# Altium schematic sheet I2C_EEPROM_AT24C32.SchDoc
size A4; SheetNumber: 11; SheetTotal: 16
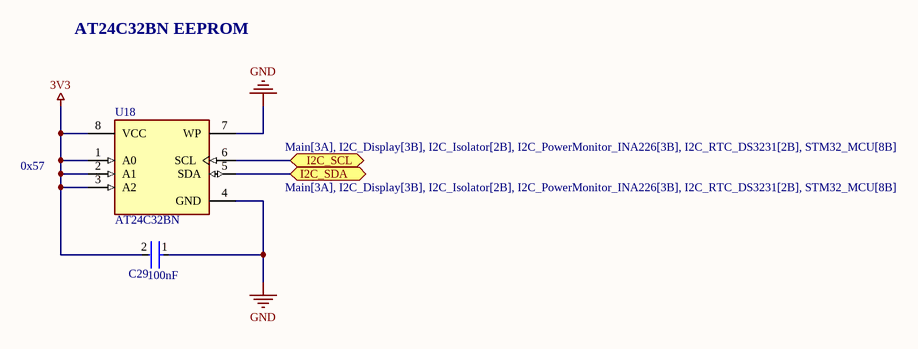
[diagram p0: I2C_EEPROM_AT24C32.SchDoc]

## Parts
C29  100nF  [FP-CGA3E-0_3-0_1-IPC_A]
U18  AT24C32BN  [FP-C04-057-SN-MFG]

## Ports
I2C_SCL (bidir, see Main[3A], I2C_Display[3B], I2C_Isolator[2B], I2C_PowerMonitor_INA226[3B], I2C_RTC_DS3231[2B], STM32_MCU[8B]), I2C_SDA (bidir, see Main[3A], I2C_Display[3B], I2C_Isolator[2B], I2C_PowerMonitor_INA226[3B], I2C_RTC_DS3231[2B], STM32_MCU[8B])

## Nets
3V3: C29.2 U18.1(A0) U18.2(A1) U18.3(A2) U18.8(VCC)
GND: C29.1 U18.4(GND) U18.7(WP)
I2C_SCL: U18.6(SCL) ; port I2C_SCL
I2C_SDA: U18.5(SDA) ; port I2C_SDA

## Notes on the sheet
- AT24C32BN EEPROM
- 0x57

## Library data of the parts
C29 = CMP-2000-07546-2: Cap Ceramic 100nF 50V X7R 10% Pad SMD 0603 +125°C Automotive T/R; Weight: 7.1E-05oz; Composition: Ceramic; Max Operating Temperature: 125°C; Termination: SMD/SMT; Dielectric: X7R; Length: 1.6mm; Package Quantity: 1; REACH SVHC: No SVHC; Lead Free: Lead Free; Case Code (Metric): 1608; Min Operating Temperature: -55°C; Packaging: Tape and Reel; Tolerance: 10%; Voltage Rating: 50V; Case Code (Imperial): 0603; Capacitance: 100nF; Case/Package: 0603; Voltage Rating (DC): 50V; Depth: 0.8mm; Radiation Hardening: No; Ratings: AEC-Q200; Mount: Surface Mount; Voltage: 50V; Thickness: 0.035inch; Width: 0.8mm; Height: 0.8mm
U18 = CMP-06313-000164-1: IC EEPROM 32KBIT I2C 1MHZ 8SOIC; Interface: Serial; Supply Current: 3mA; Organization: 4KX8; Access Time: 550ns; Number of Words: 4096; Max Supply Voltage: 5.5V; Memory Size: 32Kb; Write Protection: YES; Operating Supply Voltage: 5V; Min Supply Voltage: 1.7V; RoHS Compliant: Yes; Radiation Hardening: No; Height: 1.5mm; Frequency: 1MHz; Memory Type: EEPROM; Min Operating Temperature: -40°C; Packaging: Bulk; Case/Package: SOIC; Max Frequency: 1MHz; Package Quantity: 100; Mount: Surface Mount; Density: 32Kb; Series: -; Length: 5.05mm; Number of Pins: 8; Max Operating Temperature: 85°C; Reach SVHC Compliant: Yes; Nominal Supply Current: 3mA; Width: 3.99mm; Access Time-Max: 550ns